# Altium schematic sheet 15.EEROM.SchDoc
size 297 x 209 mm
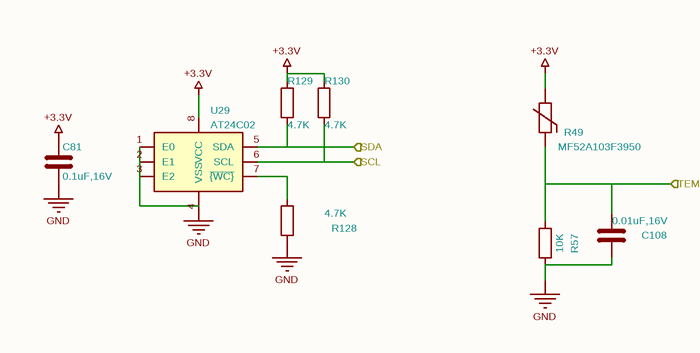
[diagram p0: 15.EEROM.SchDoc]

## Parts
C81  0.1uF,16V  [C_0402]
C108  0.01uF,16V  [C_0402_1005Metric]
R49  MF52A103F3950  [RES-TH_L2.5-W2.5-P1.70-D0.3]
R57  10K  [R_0402_1005Metric]
R128  4.7K  [R_0402_1005Metric]
R129  4.7K  [R_0402_1005Metric]
R130  4.7K  [R_0402_1005Metric]
U29  AT24C02  [SOIC-8]

## Ports
SCL (in), SDA (in), TEMP (in)

## Nets
+3.3V: C81.1 R49.2 R129.2 R130.2 U29.8(VCC)
GND: C81.2 C108.2 R57.1 R128.2 U29.1(E0) U29.2(E1) U29.3(E2) U29.4(VSS)
SCL: R130.1 U29.6(SCL) ; port SCL
SDA: R129.1 U29.5(SDA) ; port SDA
TEMP: C108.1 R49.1 R57.2 ; port TEMP
NetR128_1: R128.1 U29.7(~{{WC}})

## Notes on the sheet
- 1
- 2
- 3
- 4
- 5
- 6
- A
- B
- C
- D
- Title: HPM6E8Y_RbMotor_ECAT
- File: 15.EEROM.kicad_sch
- Sheet: /
- KiCad E.D.A.  kicad (5.1.4)-1
- Size: A4
- Date:
- Rev: RevB+
- Id: 1/1

## Library data of the parts
C81 = 0.1uF,16V: Model: CL05B104KO5NNNC; Company: SAMSUNG(三星); Value: 0.1uF,16V; Footprint: 03_HPM_Capacitance:C_0402
C108 = 10nF,16V_0402: Model: CC0402KRX7R7BB103; Company: YAGEO(国巨); Value: 0.01uF,16V; Footprint: 03_HPM_Capacitance:C_0402_1005Metric
R49 = MF52A103F3950: Company: SURGING(绍鑫); SuppliersPartNumber: C5439706; Model: MF52A103F3950; Value: MF52A103F3950; Footprint: 02_HPM_Resistor:RES-TH_L2.5-W2.5-P1.70-D0.3
R57 = 10K_0402: Model: 0402WGF1002TCE; Company: UNI-ROYAL(厚声); Value: 10K; Footprint: 02_HPM_Resistor:R_0402_1005Metric
R128-R130 = 4.7K_0402: Model: 0402WGF4701TCE; Company: UNI-ROYAL(厚声); Value: 4.7K; Footprint: 02_HPM_Resistor:R_0402_1005Metric
U29 = AT24C02: Company: IDCHIP(英锐芯); Model: AT24C02; Value: AT24C02; Footprint: 06_HPM_SO:SOIC-8